# EAGLE schematic NANO_shield_PORTS_1 (EAGLE 7.5.0)
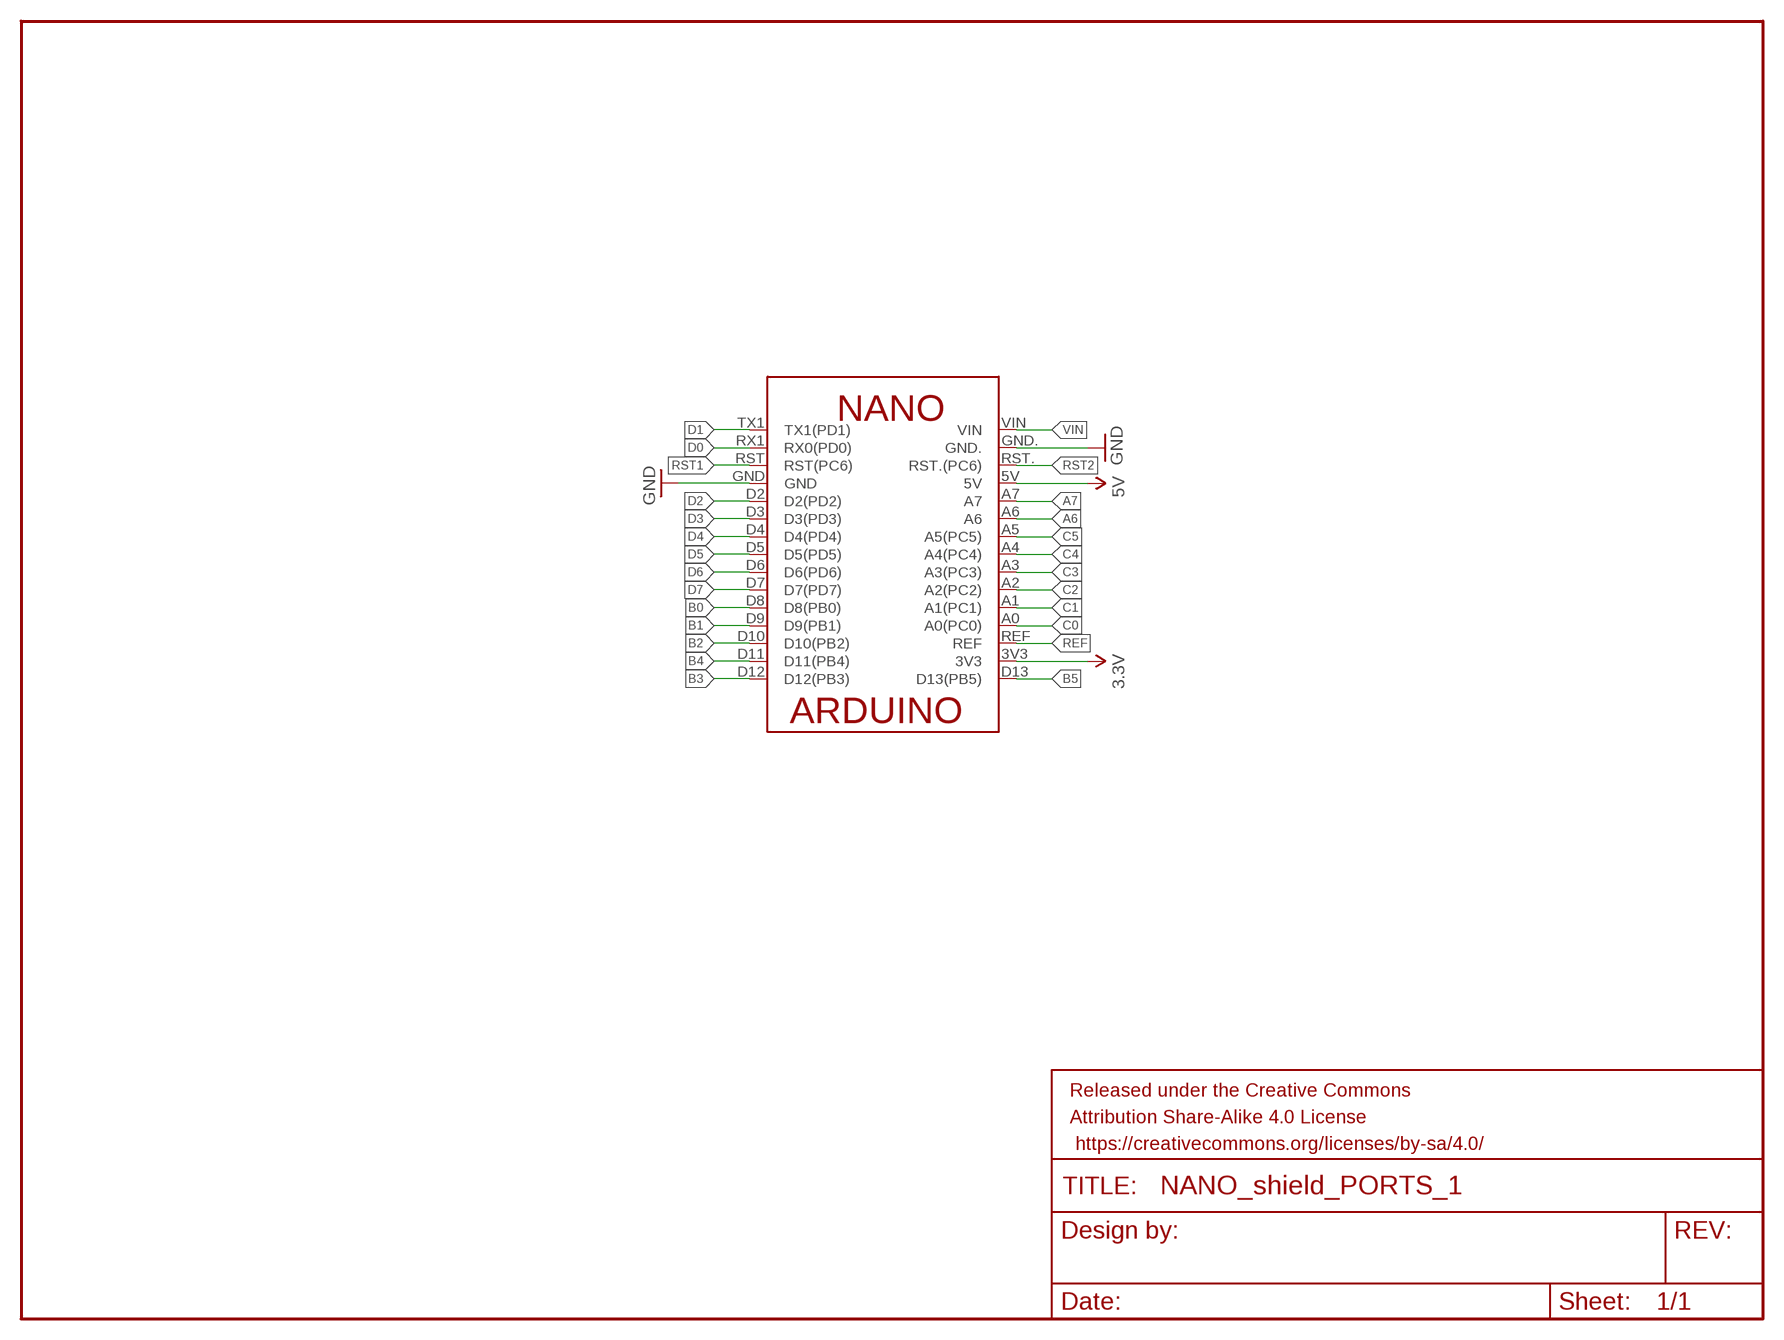
[diagram p0: schematic, sheet 1]

## Parts
FRAME1  FRAME-LETTER  [CREATIVE_COMMONS]
NANO_SHIELD  ARDUINO_NANO_MIN  [ARDUINO_NANO_MIN]

## Nets
3.3V: NANO_SHIELD.3V3
5V: NANO_SHIELD.5V
A6: NANO_SHIELD.A6
A7: NANO_SHIELD.A7
B0: NANO_SHIELD.D8(D8(PB0))
B1: NANO_SHIELD.D9(D9(PB1))
B2: NANO_SHIELD.D10(D10(PB2))
B3: NANO_SHIELD.D12(D12(PB3))
B4: NANO_SHIELD.D11(D11(PB4))
B5: NANO_SHIELD.D13(D13(PB5))
C0: NANO_SHIELD.A0(A0(PC0))
C1: NANO_SHIELD.A1(A1(PC1))
C2: NANO_SHIELD.A2(A2(PC2))
C3: NANO_SHIELD.A3(A3(PC3))
C4: NANO_SHIELD.A4(A4(PC4))
C5: NANO_SHIELD.A5(A5(PC5))
D0: NANO_SHIELD.RX1(RX0(PD0))
D1: NANO_SHIELD.TX1(TX1(PD1))
D2: NANO_SHIELD.D2(D2(PD2))
D3: NANO_SHIELD.D3(D3(PD3))
D4: NANO_SHIELD.D4(D4(PD4))
D5: NANO_SHIELD.D5(D5(PD5))
D6: NANO_SHIELD.D6(D6(PD6))
D7: NANO_SHIELD.D7(D7(PD7))
GND: NANO_SHIELD.GND NANO_SHIELD.GND.
REF: NANO_SHIELD.REF
RST1: NANO_SHIELD.RST(RST(PC6))
RST2: NANO_SHIELD.RST.(RST.(PC6))
VIN: NANO_SHIELD.VIN

## Library data of the parts
FRAME1 = SparkFun-Aesthetics:FRAME-LETTER: Schematic Frame Standard 8.5x11 US Letter frame
NANO_SHIELD = Arduino:ARDUINO_NANO_MIN: Device for representing an Arduino Nano board with a footprint in an EAGLE design. Created by Dave Young for Element14. More EAGLE documentation at: http://www.element14.com/community/community/knode/cadsoft_eagle